# Altium schematic sheet 宁波2号线PIS_TQ2416底板_原理图_V0.1.schdoc
size 594 x 419 mm; SheetNumber: 0; SheetTotal: 0
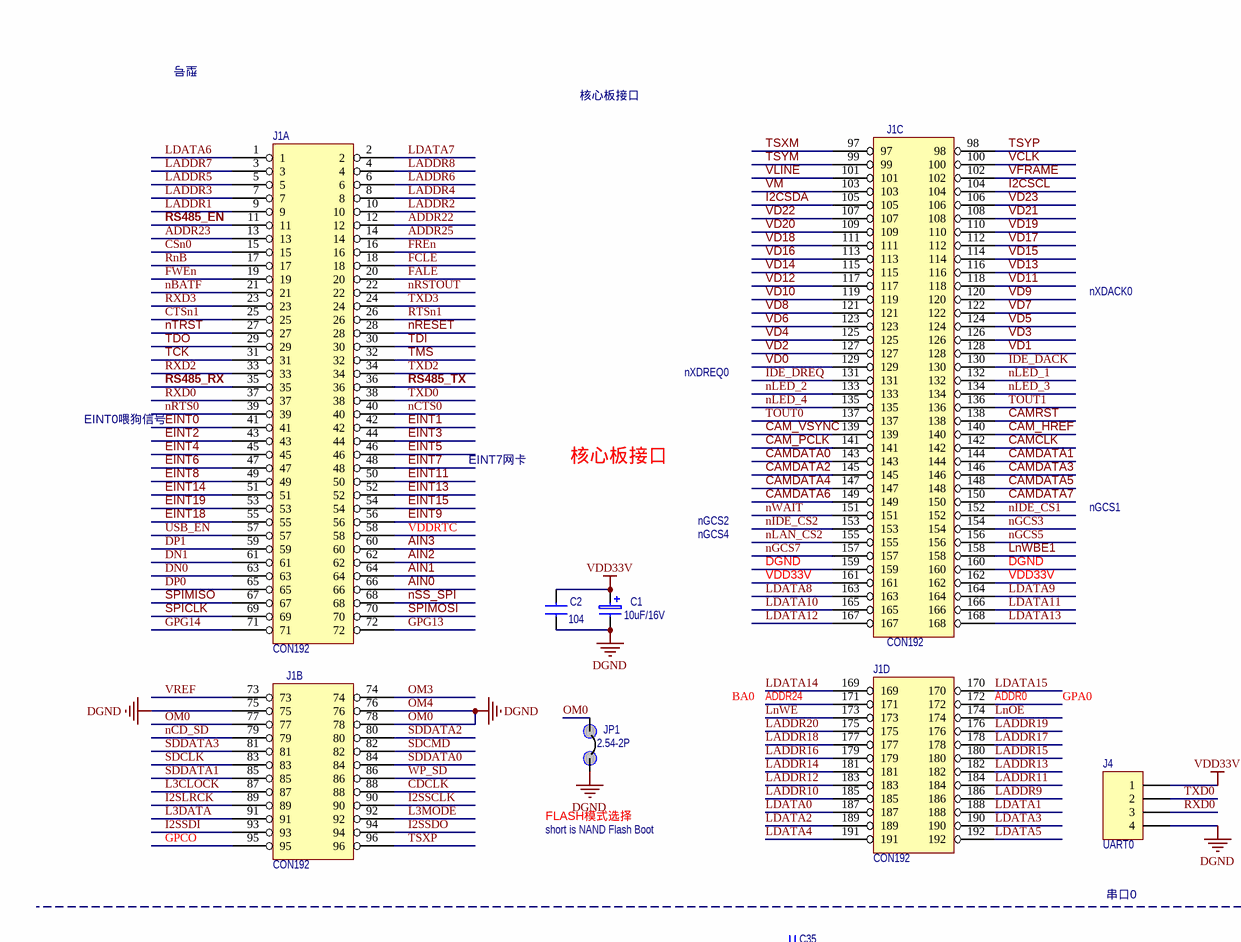
[diagram p0: 宁波2号线PIS_TQ2416底板_原理图_V0.1.schdoc, top left]
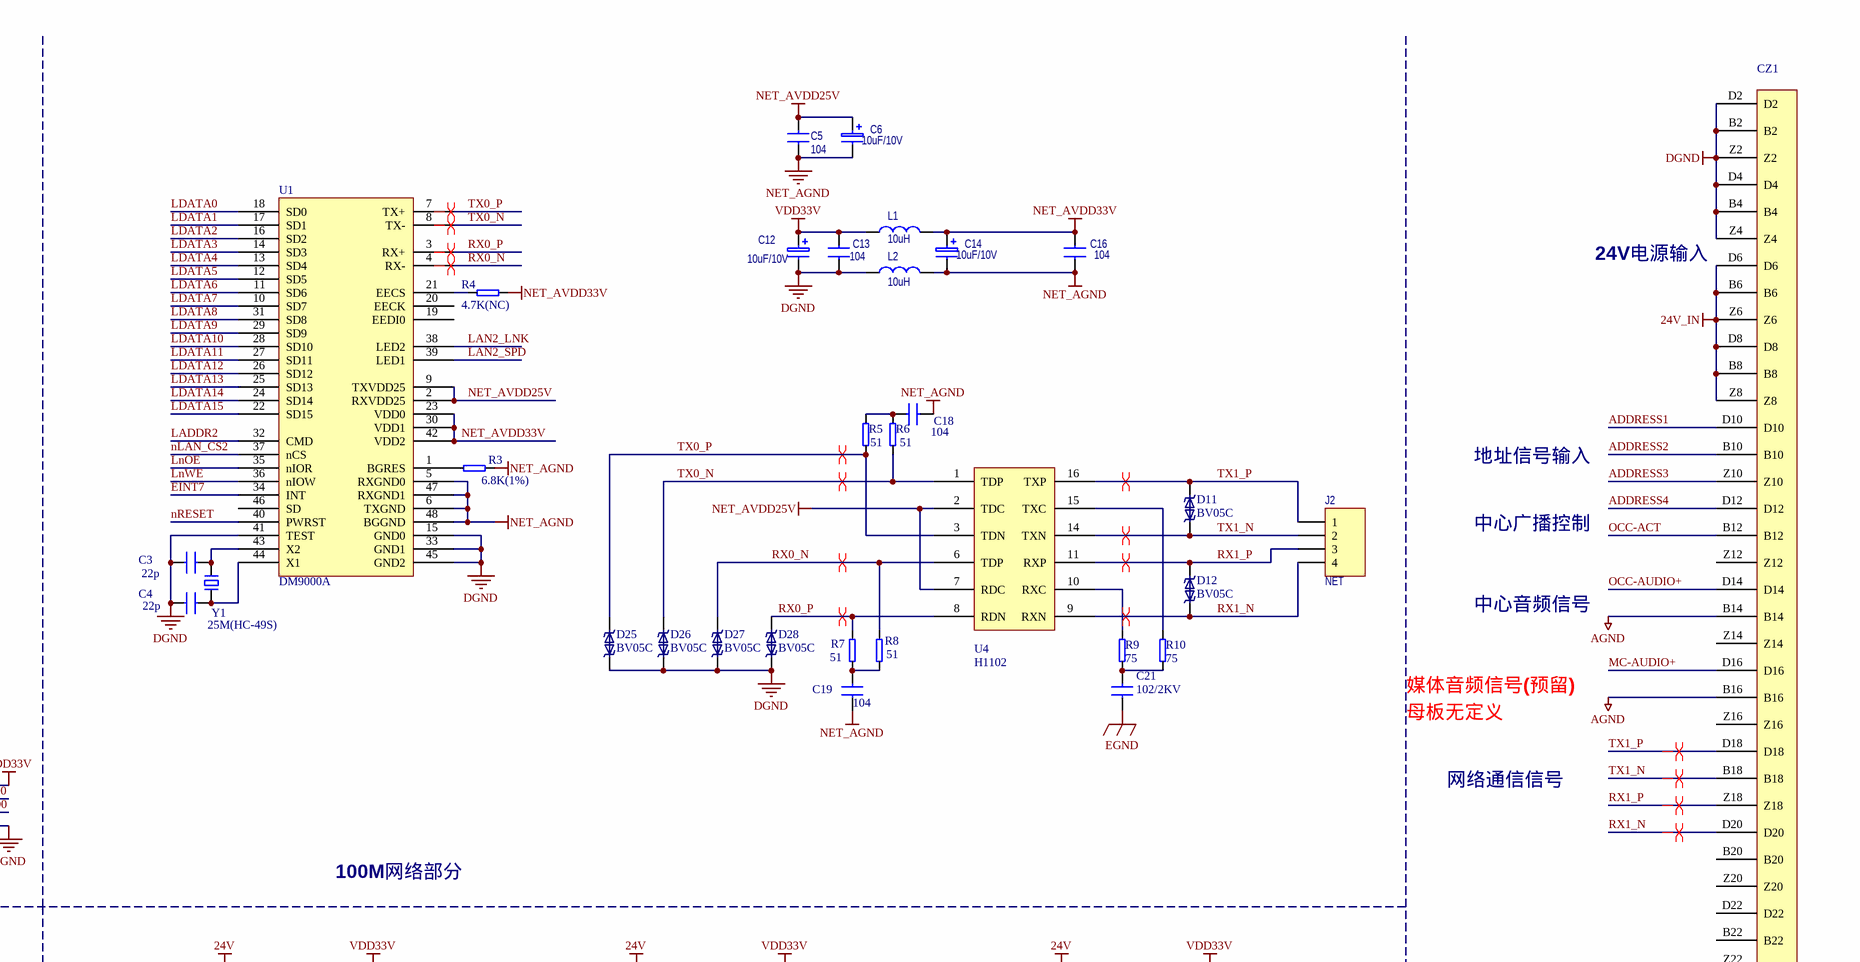
[diagram p1: 宁波2号线PIS_TQ2416底板_原理图_V0.1.schdoc, top right]
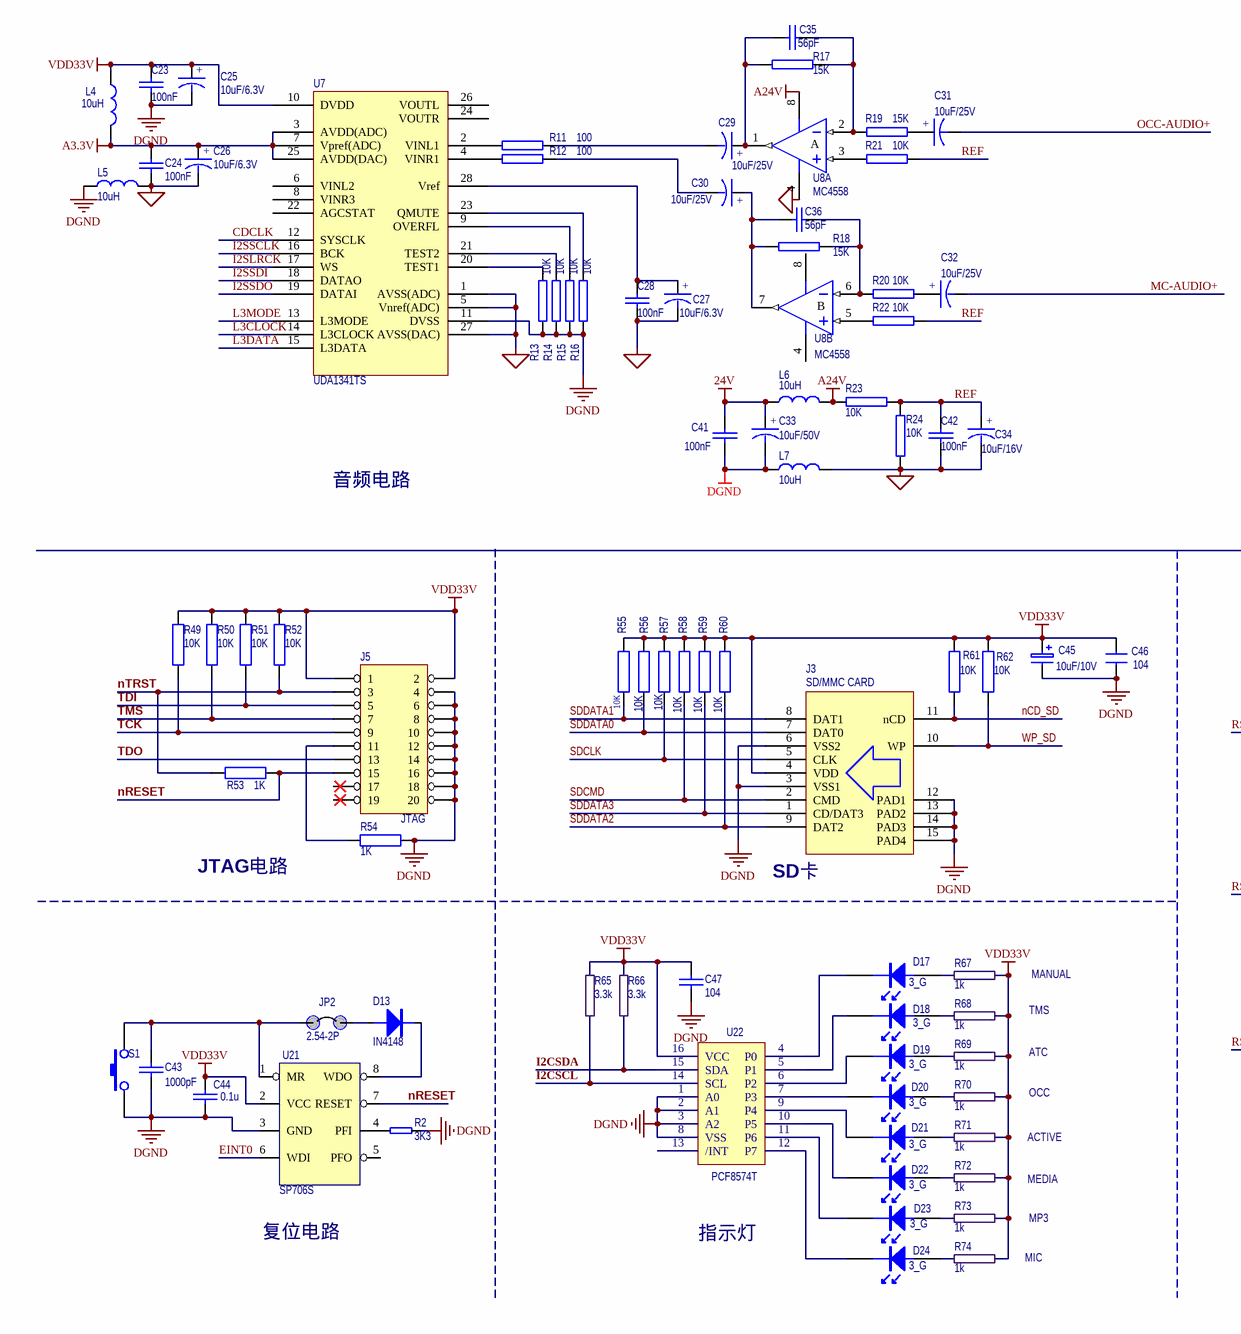
[diagram p2: 宁波2号线PIS_TQ2416底板_原理图_V0.1.schdoc, bottom left]
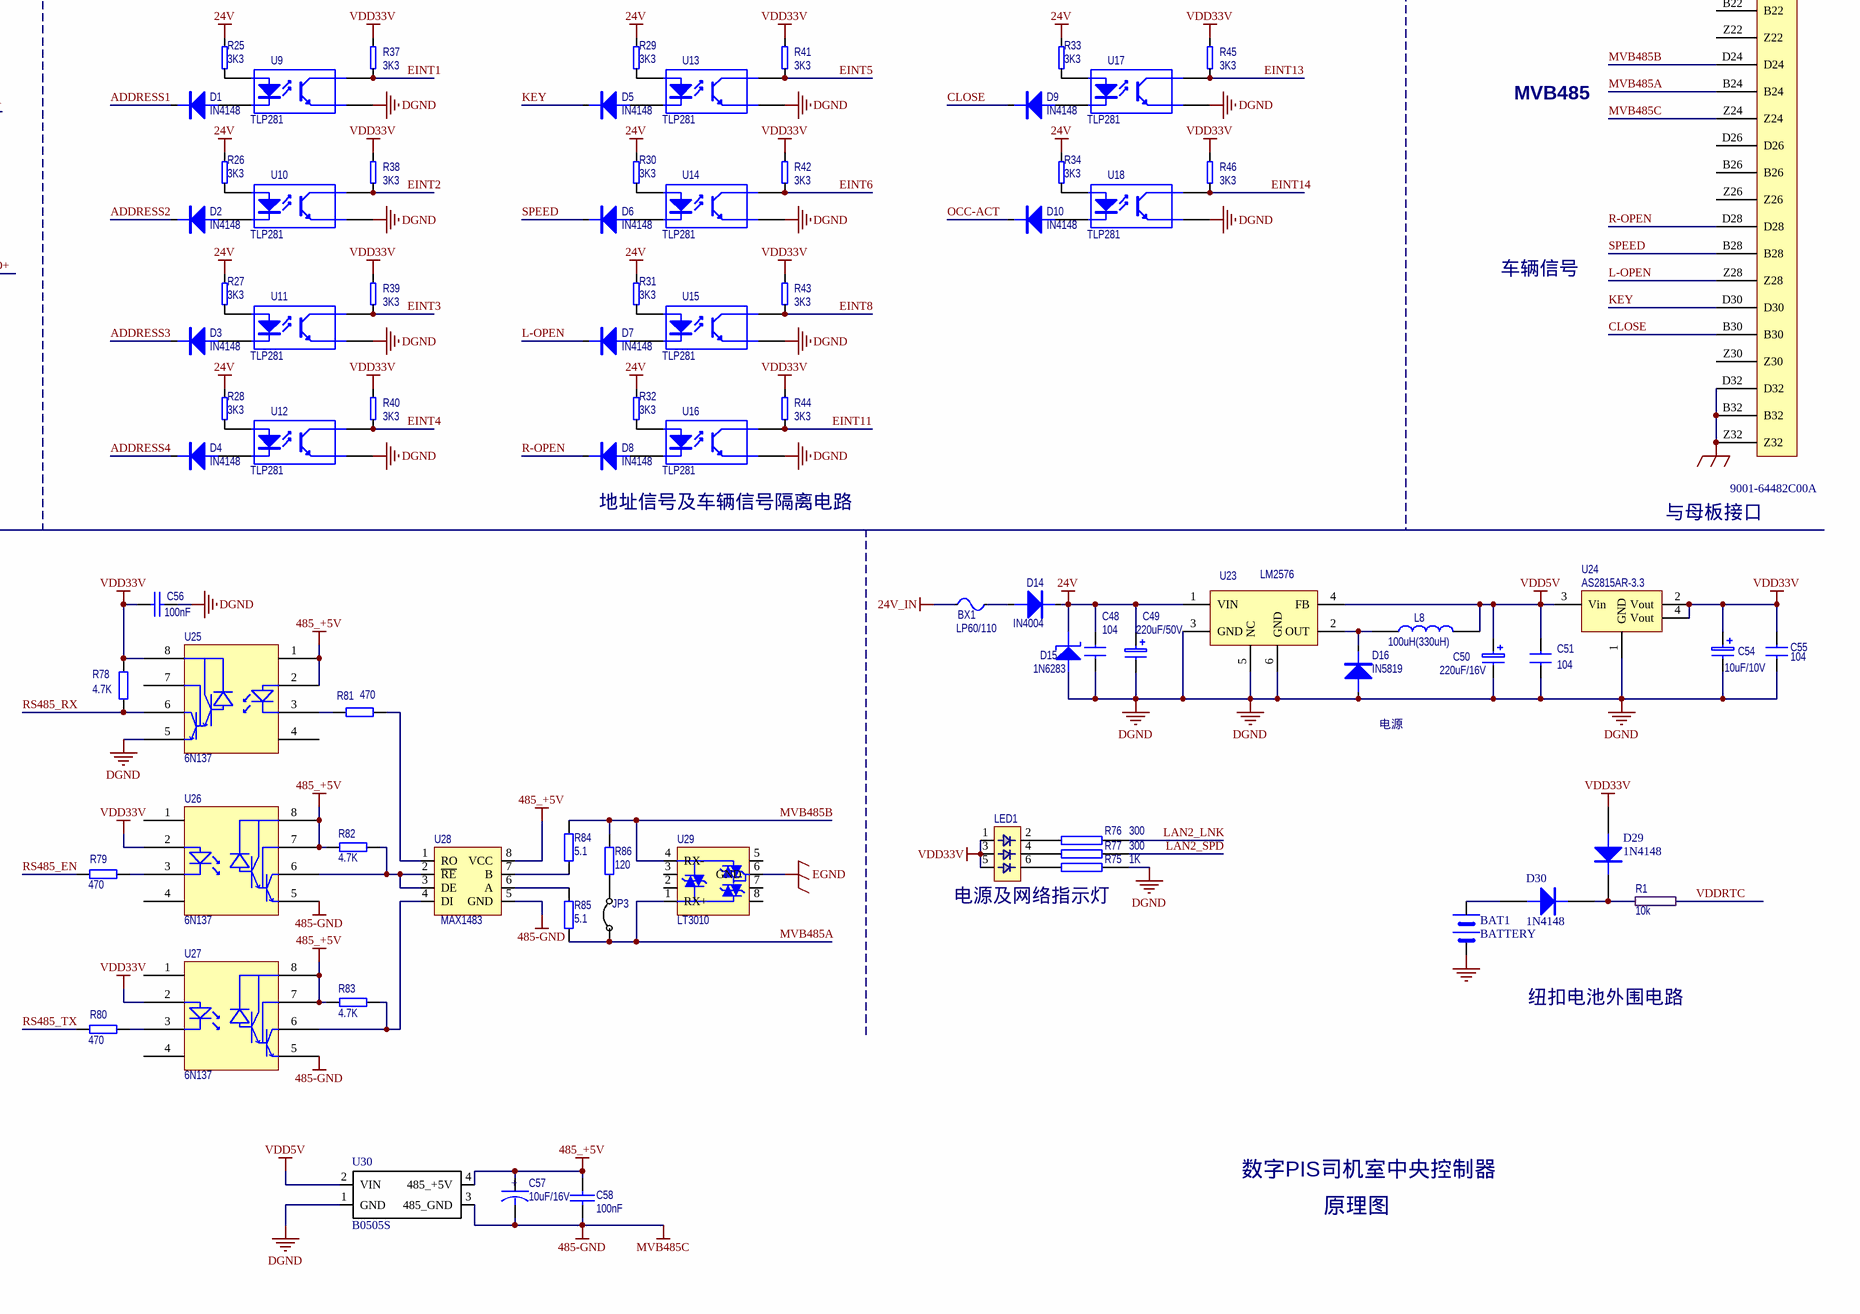
[diagram p3: 宁波2号线PIS_TQ2416底板_原理图_V0.1.schdoc, bottom right]

## Parts
BAT1  BATTERY  [BAT600]
BX1  LP60/110  [BX]
C1  value 10uF/16V  [1206E]  (hidden comment: 10uF/10V)
C2  104  [0805C]
C3  22p  [0805C]
C4  22p  [0805C]
C5  104  [0805C]
C6  10uF/10V  [1206E]
C12  10uF/10V  [1206E]
C13  104  [0805C]
C14  10uF/10V  [1206E]
C16  104  [0805C]
C18  104  [0805C]
C19  104  [0805C]
C21  102/2KV  [1206]
C23  100nF  [0805C]
C24  100nF  [0805C]
C25  10uF/6.3V  [1206E]
C26  10uF/6.3V  [1206E]
C27  10uF/6.3V  [1206E]
C28  100nF  [0805C]
C29  10uF/25V  [RB.1/.2]
C30  10uF/25V  [RB.1/.2]
C31  10uF/25V  [RB.1/.2]
C32  10uF/25V  [RB.1/.2]
C33  10uF/50V  [CAP-B]
C34  10uF/16V  [CAP-B]
C35  56pF  [0805C]
C36  56pF  [0805C]
C41  100nF  [0805C]
C42  100nF  [0805C]
C43  1000pF  [0805C]
C44  0.1u  [0805C]
C45  10uF/10V  [1206E]
C46  104  [0805C]
C47  104  [0805C]
C48  104  [0805C]
C49  220uF/50V  [RB.2/.4]
C50  220uF/16V  [RB.2/.4]
C51  104  [0805C]
C54  value 10uF/10V  [RB.2/.4]  (hidden comment: 220uF/16V)
C55  104  [0805C]
C56  100nF  [0805C]
C57  10uF/16V  [1206E]
C58  100nF  [0805C]
CZ1  9001-64482C00A  [HARTING09061486901]
D1  IN4148  [SOD-323]
D2  IN4148  [SOD-323]
D3  IN4148  [SOD-323]
D4  IN4148  [SOD-323]
D5  IN4148  [SOD-323]
D6  IN4148  [SOD-323]
D7  IN4148  [SOD-323]
D8  IN4148  [SOD-323]
D9  IN4148  [SOD-323]
D10  IN4148  [SOD-323]
D11  BV05C  [SOD-323]
D12  BV05C  [SOD-323]
D13  IN4148  [0805AK]
D14  IN4004  [1206AK]
D15  1N6283  [DIODE0.5]
D16  IN5819  [1206AK]
D17  3_G  [LED-1]
D18  3_G  [LED-1]
D19  3_G  [LED-1]
D20  3_G  [LED-1]
D21  3_G  [LED-1]
D22  3_G  [LED-1]
D23  3_G  [LED-1]
D24  3_G  [LED-1]
D25  BV05C  [SOD-323]
D26  BV05C  [SOD-323]
D27  BV05C  [SOD-323]
D28  BV05C  [SOD-323]
D29  1N4148  [SOD-323]
D30  1N4148  [SOD-323]
J1  CON192  [CON192_2.0]  (parts A,B,C,D of 4)
J2  NET  [SIP-4]
J3  SD/MMC CARD  [SD_CARD(LONG)]
J4  UART0  [SIP-4]
J5  JTAG  [DC3-20T]
JP1  2.54-2P  [JMP-2]
JP2  2.54-2P  [SIP-2]
JP3  (no value)  [SIP-2]
L1  10uH  [1206]
L2  10uH  [1206]
L4  10uH  [1206]
L5  10uH  [1206]
L6  10uH  [1206]
L7  10uH  [1206]
L8  100uH(330uH)  [DG300]
LED1  (no value)  [LED-3]
R1  10k  [0805R]
R2  3K3  [0805R]
R3  6.8K(1%)  [0805R]
R4  4.7K(NC)  [0805R]
R5  51  [0805R]
R6  51  [0805R]
R7  51  [0805R]
R8  51  [0805R]
R9  75  [0805R]
R10  75  [0805R]
R11  100  [0805R]
R12  100  [0805R]
R13  10K  [0805R]
R14  10K  [0805R]
R15  10K  [0805R]
R16  10K  [0805R]
R17  15K  [0805R]
R18  15K  [0805R]
R19  15K  [0805R]
R20  10K  [0805R]
R21  10K  [0805R]
R22  10K  [0805R]
R23  10K  [0805R]
R24  10K  [0805R]
R25  3K3  [0805R]
R26  3K3  [0805R]
R27  3K3  [0805R]
R28  3K3  [0805R]
R29  3K3  [0805R]
R30  3K3  [0805R]
R31  3K3  [0805R]
R32  3K3  [0805R]
R33  3K3  [0805R]
R34  3K3  [0805R]
R37  3K3  [0805R]
R38  3K3  [0805R]
R39  3K3  [0805R]
R40  3K3  [0805R]
R41  3K3  [0805R]
R42  3K3  [0805R]
R43  3K3  [0805R]
R44  3K3  [0805R]
R45  3K3  [0805R]
R46  3K3  [0805R]
R49  10K  [0805R]
R50  10K  [0805R]
R51  10K  [0805R]
R52  10K  [0805R]
R53  1K  [0805R]
R54  1K  [0805R]
R55  10K  [0805R]
R56  10K  [0805R]
R57  10K  [0805R]
R58  10K  [0805R]
R59  10K  [0805R]
R60  10K  [0805R]
R61  10K  [0805R]
R62  10K  [0805R]
R65  3.3k  [0805R]
R66  3.3k  [0805R]
R67  1k  [0805R]
R68  1k  [0805R]
R69  1k  [0805R]
R70  1k  [0805R]
R71  1k  [0805R]
R72  1k  [0805R]
R73  1k  [0805R]
R74  1k  [0805R]
R75  1K  [0805R]
R76  300  [0805R]
R77  300  [0805R]
R78  4.7K  [0805R]
R79  470  [0805R]
R80  470  [0805R]
R81  470  [0805R]
R82  4.7K  [0805R]
R83  4.7K  [0805R]
R84  5.1  [0805R]
R85  5.1  [0805R]
R86  120  [0805R]
S1  (no value)  [KEY-6A]
U1  DM9000A  [LQFP-48]
U4  H1102  [SOP-16(Wide)]
U7  UDA1341TS  [TSSOP-28]
U8  MC4558  [SOP-8]  (parts A,B of 2)
U9  TLP281  [SOP-4]
U10  TLP281  [SOP-4]
U11  TLP281  [SOP-4]
U12  TLP281  [SOP-4]
U13  TLP281  [SOP-4]
U14  TLP281  [SOP-4]
U15  TLP281  [SOP-4]
U16  TLP281  [SOP-4]
U17  TLP281  [SOP-4]
U18  TLP281  [SOP-4]
U21  SP706S  [SOP-8]
U22  PCF8574T  [SOP-16]
U23  LM2576  [LM2576]
U24  AS2815AR-3.3  [TO-252]
U25  6N137  [SOP-8-2.54]
U26  6N137  [SOP-8-2.54]
U27  6N137  [SOP-8-2.54]
U28  MAX1483  [SOP-8]
U29  LT3010  [SOP-8]
U30  B0505S  [B0505S]
Y1  25M(HC-49S)  [CRYSTAL]

## Nets
24V: C33.1 C41.1 C48.1 C49.1 D14.K D15.K L6.1 R25.2 R26.2 R27.2 R28.2 R29.2 R30.2 R31.2 R32.2 R33.2 R34.2 U23.1(VIN)
24V_IN: BX1.2 CZ1.B6 CZ1.B8 CZ1.D6 CZ1.D8 CZ1.Z6 CZ1.Z8
485_+5V: C57.1 C58.2 R82.1 R83.2 U25.1 U25.2 U26.7 U26.8 U27.7 U27.8 U28.8(VCC) U30.4(485_+5V)
A3.3V: C24.2 C26.1 L4.2 U7.3(AVDD(ADC)) U7.7(Vpref(ADC)) U7.25(AVDD(DAC))
A24V: L6.2 R23.2 U8.8(V+)
AGND: C24.1 C26.2 C27.2 C28.2 C34.2 C42.2 CZ1.B14 CZ1.B16 L5.2 L7.2 R24.2 U7.1(AVSS(ADC)) U7.5(Vnref(ADC)) U7.27(AVSS(DAC)) U8.4(V-)
DGND: BAT1.2 C1.2 C2.2 C3.1 C4.1 C12.2 C13.2 C23.1 C25.2 C33.2 C41.2 C43.2 C44.1 C45.2 C46.2 C47.1 C48.2 C49.2 C50.2 C51.2 C54.2 C55.2 C56.2 CZ1.B2 CZ1.B4 CZ1.D2 CZ1.D4 CZ1.Z2 CZ1.Z4 D15.A D16.A D25.A D26.A D27.A D28.A J1.75 J1.76 J1.77 J1.78 J1.159 J1.160 J3.3(VSS1) J3.6(VSS2) J3.12(PAD1) J3.13(PAD2) J3.14(PAD3) J3.15(PAD4) J4.4 J5.4 J5.6 J5.8 J5.10 J5.12 J5.14 J5.16 J5.18 J5.20 JP1.1 JP1.2 L2.1 L5.1 L7.1 R2.1 R13.1 R14.1 R15.1 R16.1 R54.2(BOT) R75.2 S1.1 U1.15(GND0) U1.33(GND1) U1.41(TEST) U1.45(GND2) U7.11(DVSS) U9.3(E) U10.3(E) U11.3(E) U12.3(E) U13.3(E) U14.3(E) U15.3(E) U16.3(E) U17.3(E) U18.3(E) U21.3(GND) U22.1(A0) U22.2(A1) U22.3(A2) U22.8(VSS) U23.3(GND) U23.5(NC) U23.6(GND) U24.1(GND) U25.5 U30.1(GND)  [also labelled OM0, OM4]
EGND: C21.2 CZ1.B32 CZ1.D32 CZ1.Z32 U29.6(GND)
MVB485C: C57.2 C58.1 CZ1.Z24 U26.5 U27.5 U28.5(GND) U30.3(485_GND)  [also labelled 485-GND]
NET_AGND: C5.2 C6.2 C14.2 C16.2 C18.2 C19.1 L2.2 R3.2 U1.5(RXGND0) U1.6(TXGND) U1.47(RXGND1) U1.48(BGGND)
NET_AVDD25V: C5.1 C6.1 U1.2(RXVDD25) U1.9(TXVDD25) U4.2(TDC) U4.7(RDC)
NET_AVDD33V: C14.1 C16.1 L1.2 R4.2 U1.23(VDD0) U1.30(VDD1) U1.42(VDD2)
VDD5V: C50.1 C51.1 L8.2 U23.4(FB) U24.3(Vin) U30.2(VIN)
VDD33V: C1.1 C2.1 C12.1 C13.1 C23.2 C25.1 C44.2 C45.1 C46.1 C47.2 C54.1 C55.1 C56.1 D29.A J1.161 J1.162 J3.4(VDD) J4.1 J5.1 J5.2 L1.1 L4.1 LED1.1 LED1.3 LED1.5 R37.2 R38.2 R39.2 R40.2 R41.2 R42.2 R43.2 R44.2 R45.2 R46.2 R49.1(TOP) R50.1(TOP) R51.1(TOP) R52.1(TOP) R55.1(TOP) R56.1(TOP) R57.1(TOP) R58.1(TOP) R59.1(TOP) R60.1(TOP) R61.1(TOP) R62.1(TOP) R65.1 R66.1 R67.1 R68.1 R69.1 R70.1 R71.1 R72.1 R73.1 R74.1 R78.2 U7.10(DVDD) U21.2(VCC) U22.16(VCC) U24.2(Vout) U24.4(Vout) U25.8 U26.2 U27.2
ADDR22: J1.12
ADDR23: J1.13
ADDR25: J1.14
ADDRESS1: CZ1.D10 D1.K
ADDRESS2: CZ1.B10 D2.K
ADDRESS3: CZ1.Z10 D3.K
ADDRESS4: CZ1.D12 D4.K
AIN0: J1.66
AIN1: J1.64
AIN2: J1.62
AIN3: J1.60
CAM_HREF: J1.140
CAM_PCLK: J1.141
CAM_VSYNC: J1.139
CAMCLK: J1.142
CAMDATA0: J1.143
CAMDATA1: J1.144
CAMDATA2: J1.145
CAMDATA3: J1.146
CAMDATA4: J1.147
CAMDATA5: J1.148
CAMDATA6: J1.149
CAMDATA7: J1.150
CAMRST: J1.138
CDCLK: J1.88 U7.12(SYSCLK)
CLOSE: CZ1.B30 D9.K
CSn0: J1.15
CTSn1: J1.25
DN0: J1.63
DN1: J1.61
DP0: J1.65
DP1: J1.59
EINT0: J1.41 U21.6(WDI)
EINT1: J1.42 R37.1 U9.4(C)
EINT2: J1.43 R38.1 U10.4(C)
EINT3: J1.44 R39.1 U11.4(C)
EINT4: J1.45 R40.1 U12.4(C)
EINT5: J1.46 R41.1 U13.4(C)
EINT6: J1.47 R42.1 U14.4(C)
EINT7: J1.48 U1.34(INT)
EINT8: J1.49 R43.1 U15.4(C)
EINT9: J1.56
EINT11: J1.50 R44.1 U16.4(C)
EINT13: J1.52 R45.1 U17.4(C)
EINT14: J1.51 R46.1 U18.4(C)
EINT15: J1.54
EINT18: J1.55
EINT19: J1.53
FALE: J1.20
FCLE: J1.18
FREn: J1.16
FWEn: J1.19
GPCO: J1.95
GPG13: J1.72
GPG14: J1.71
I2CSCL: J1.104 R65.2 U22.14(SCL)
I2CSDA: J1.105 R66.2 U22.15(SDA)
I2SLRCK: J1.89 U7.17(WS)
I2SSCLK: J1.90 U7.16(BCK)
I2SSDI: J1.93 U7.18(DATAO)
I2SSDO: J1.94 U7.19(DATAI)
IDE_DACK: J1.130
IDE_DREQ: J1.131
KEY: CZ1.D30 D5.K
L3CLOCK: J1.87 U7.14(L3CLOCK)
L3DATA: J1.91 U7.15(L3DATA)
L3MODE: J1.92 U7.13(L3MODE)
L-OPEN: CZ1.Z28 D7.K
LADDR1: J1.9
LADDR2: J1.10 U1.32(CMD)
LADDR3: J1.7
LADDR4: J1.8
LADDR5: J1.5
LADDR6: J1.6
LADDR7: J1.3
LADDR8: J1.4
LADDR9: J1.186
LADDR10: J1.185
LADDR11: J1.184
LADDR12: J1.183
LADDR13: J1.182
LADDR14: J1.181
LADDR15: J1.180
LADDR16: J1.179
LADDR17: J1.178
LADDR18: J1.177
LADDR19: J1.176
LADDR20: J1.175
LAN2_LNK: R76.2 U1.38(LED2)
LAN2_SPD: R77.2 U1.39(LED1)
LDATA0: J1.187 U1.18(SD0)
LDATA1: J1.188 U1.17(SD1)
LDATA2: J1.189 U1.16(SD2)
LDATA3: J1.190 U1.14(SD3)
LDATA4: J1.191 U1.13(SD4)
LDATA5: J1.192 U1.12(SD5)
LDATA6: J1.1 U1.11(SD6)
LDATA7: J1.2 U1.10(SD7)
LDATA8: J1.163 U1.31(SD8)
LDATA9: J1.164 U1.29(SD9)
LDATA10: J1.165 U1.28(SD10)
LDATA11: J1.166 U1.27(SD11)
LDATA12: J1.167 U1.26(SD12)
LDATA13: J1.168 U1.25(SD13)
LDATA14: J1.169 U1.24(SD14)
LDATA15: J1.170 U1.22(SD15)
LnOE: J1.174 U1.35(nIOR)
LnWBE1: J1.158
LnWE: J1.173 U1.36(nIOW)
MC-AUDIO+: C32.2 CZ1.D16
MVB485A: CZ1.B24 JP3.1 R85.2 U29.1(RX+)
MVB485B: CZ1.D24 R84.1 R86.2 U29.4(RX-)
nBATF: J1.21
nCD_SD: J1.79 J3.11(nCD) R61.2(BOT)
nCTS0: J1.40
nGCS3: J1.154
nGCS5: J1.156
nGCS7: J1.157
nIDE_CS1: J1.152
nIDE_CS2: J1.153
nLAN_CS2: J1.155 U1.37(nCS)
nLED_1: J1.132
nLED_2: J1.133
nLED_3: J1.134
nLED_4: J1.135
nRESET: J1.28 J5.15 R53.2(BOT) U1.40(PWRST) U21.7(RESET)
nRSTOUT: J1.22
nRTS0: J1.39
nSS_SPI: J1.68
nTRST: J1.27 J5.3 R52.2(BOT) R53.1(TOP)
nWAIT: J1.151
OCC-ACT: CZ1.B12 D10.K
OCC-AUDIO+: C31.2 CZ1.D14
OM3: J1.74
R-OPEN: CZ1.D28 D8.K
REF: C34.1 C42.1 R21.2 R22.1 R23.1 R24.1
RnB: J1.17
RS485_EN: J1.11 R79.1
RS485_RX: J1.35 R78.1 U25.6
RS485_TX: J1.36 R80.1
RTSn1: J1.26
RX0_N: D27.K R8.2 U1.4(RX-) U4.6(TDP)
RX0_P: D28.K R7.2 U1.3(RX+) U4.8(RDN)
RX1_N: CZ1.D20 D12.A J2.4 U4.9(RXN)
RX1_P: CZ1.Z18 D12.K J2.3 U4.11(RXP)
RXD0: J1.37 J4.3
RXD2: J1.33
RXD3: J1.23
SDCLK: J1.83 J3.5(CLK) R57.2(BOT)
SDCMD: J1.82 J3.2(CMD) R58.2(BOT)
SDDATA0: J1.84 J3.7(DAT0) R56.2(BOT)
SDDATA1: J1.85 J3.8(DAT1) R55.2(BOT)
SDDATA2: J1.80 J3.9(DAT2) R60.2(BOT)
SDDATA3: J1.81 J3.1(CD/DAT3) R59.2(BOT)
SPEED: CZ1.B28 D6.K
SPICLK: J1.69
SPIMISO: J1.67
SPIMOSI: J1.70
TCK: J1.31 J5.9 R49.2(BOT)
TDI: J1.30 J5.5 R51.2(BOT)
TDO: J1.29 J5.13
TMS: J1.32 J5.7 R50.2(BOT)
TOUT0: J1.137
TOUT1: J1.136
TSXM: J1.97
TSXP: J1.96
TSYM: J1.99
TSYP: J1.98
TX0_N: D26.K R6.1 U1.8(TX-) U4.1(TDP)
TX0_P: D25.K R5.1 U1.7(TX+) U4.3(TDN)
TX1_N: CZ1.B18 D11.A J2.2 U4.14(TXN)
TX1_P: CZ1.D18 D11.K J2.1 U4.16(TXP)
TXD0: J1.38 J4.2
TXD2: J1.34
TXD3: J1.24
USB_EN: J1.57
VCLK: J1.100
VD0: J1.129
VD1: J1.128
VD2: J1.127
VD3: J1.126
VD4: J1.125
VD5: J1.124
VD6: J1.123
VD7: J1.122
VD8: J1.121
VD9: J1.120
VD10: J1.119
VD11: J1.118
VD12: J1.117
VD13: J1.116
VD14: J1.115
VD15: J1.114
VD16: J1.113
VD17: J1.112
VD18: J1.111
VD19: J1.110
VD20: J1.109
VD21: J1.108
VD22: J1.107
VD23: J1.106
VDDRTC: J1.58 R1.2
VFRAME: J1.102
VLINE: J1.101
VM: J1.103
VREF: J1.73
WP_SD: J1.86 J3.10(WP) R62.2(BOT)
NetBAT1_1: BAT1.1 D30.A
NetBX1_1: BX1.1 D14.A
NetC3_2: C3.2 U1.43(X2) Y1.1
NetC4_2: C4.2 U1.44(X1) Y1.2
NetC18_1: C18.1 R5.2 R6.2
NetC19_2: C19.2 R7.1 R8.1
NetC21_1: C21.1 R9.1 R10.1
NetC27_1: C27.1 C28.1 U7.28(Vref)
NetC29_1: C29.1 C35.1 R17.2 U8.1(OUT)
NetC29_2: C29.2 R11.1
NetC30_1: C30.1 C36.1 R18.2 U8.7(OUT)
NetC30_2: C30.2 R12.1
NetC31_1: C31.1 R19.2
NetC32_1: C32.1 R20.1
NetC35_2: C35.2 R17.1 R19.1 U8.2(IN-)
NetC36_2: C36.2 R18.1 R20.2 U8.6(IN-)
NetC43_1: C43.1 JP2.1 S1.2 U21.1(MR)
NetD1_A: D1.A U9.2(K)
NetD2_A: D2.A U10.2(K)
NetD3_A: D3.A U11.2(K)
NetD4_A: D4.A U12.2(K)
NetD5_A: D5.A U13.2(K)
NetD6_A: D6.A U14.2(K)
NetD7_A: D7.A U15.2(K)
NetD8_A: D8.A U16.2(K)
NetD9_A: D9.A U17.2(K)
NetD10_A: D10.A U18.2(K)
NetD13_A: D13.A JP2.2
NetD13_K: D13.K U21.8(WDO)
NetD16_K: D16.K L8.1 U23.2(OUT)
NetD17_A: D17.A R67.2
NetD17_K: D17.K U22.4(P0)
NetD18_A: D18.A R68.2
NetD18_K: D18.K U22.5(P1)
NetD19_A: D19.A R69.2
NetD19_K: D19.K U22.6(P2)
NetD20_A: D20.A R70.2
NetD20_K: D20.K U22.7(P3)
NetD21_A: D21.A R71.2
NetD21_K: D21.K U22.9(P4)
NetD22_A: D22.A R72.2
NetD22_K: D22.K U22.10(P5)
NetD23_A: D23.A R73.2
NetD23_K: D23.K U22.11(P6)
NetD24_A: D24.A R74.2
NetD24_K: D24.K U22.12(P7)
NetD29_K: D29.K D30.K R1.1
NetJ5_11: J5.11 R54.1(TOP)
NetJP3_2: JP3.2 R86.1
NetLED1_2: LED1.2 R76.1
NetLED1_4: LED1.4 R77.1
NetLED1_6: LED1.6 R75.1
NetR2_2: R2.2 U21.4(PFI)
NetR3_1: R3.1 U1.1(BGRES)
NetR4_1: R4.1 U1.21(EECS)
NetR9_2: R9.2 U4.10(RXC)
NetR10_2: R10.2 U4.15(TXC)
NetR11_2: R11.2 U7.2(VINL1)
NetR12_2: R12.2 U7.4(VINR1)
NetR13_2: R13.2 U7.20(TEST1)
NetR14_2: R14.2 U7.21(TEST2)
NetR15_2: R15.2 U7.9(OVERFL)
NetR16_2: R16.2 U7.23(QMUTE)
NetR21_1: R21.1 U8.3(IN+)
NetR22_2: R22.2 U8.5(IN+)
NetR25_1: R25.1 U9.1(A)
NetR26_1: R26.1 U10.1(A)
NetR27_1: R27.1 U11.1(A)
NetR28_1: R28.1 U12.1(A)
NetR29_1: R29.1 U13.1(A)
NetR30_1: R30.1 U14.1(A)
NetR31_1: R31.1 U15.1(A)
NetR32_1: R32.1 U16.1(A)
NetR33_1: R33.1 U17.1(A)
NetR34_1: R34.1 U18.1(A)
NetR79_2: R79.2 U26.3
NetR80_2: R80.2 U27.3
NetR81_1: R81.1 U25.3
NetR81_2: R81.2 U28.1(RO)
NetR82_2: R82.2 U26.6 U28.2(~{RE}) U28.3(DE)
NetR83_1: R83.1 U27.6 U28.4(DI)
NetR84_2: R84.2 U28.7(B)
NetR85_1: R85.1 U28.6(A)

Not connected (* = marked no-connect by the designer): CZ1 B20 B22 B26 D22 D26 Z12 Z14 Z16 Z20 Z22 Z26 Z30; J1 171 172; J5 17 19; U1 19(EEDI0) 20(EECK) 46(SD); U7 6(VINL2) 8(VINR3) 22(AGCSTAT) 24(VOUTR) 26(VOUTL); U21 5(PFO); U22 13(/INT); U25 4 7; U26 1 4; U27 1 4; U29 2(NC) 3(NC) 5(NC) 7(NC) 8(NC)

## Layout directives
differential pair: (no net found under the mark), RX0_N, RX0_P, RX1_N, RX1_P, TX0_N, TX0_P, TX1_N, TX1_P

## Notes on the sheet
- 型号
- 核心板接口
- nXDACK0
- 24V电源输入
- nXDREQ0
- EINT0喂狗信号
- EINT7网卡
- nGCS1
- 地址信号输入
- nGCS4
- nGCS2
- 中心广播控制
- 中心音频信号
- BA0
- ADDR24
- (near J1) ADDR0
- GPA0
- 媒体音频信号(预留)
- 母板无定义
- (near JP1) FLASH模式选择
- short is NAND Flash Boot
- 网络通信信号
- 串口0
- 100M网络部分
- MVB485
- 车辆信号
- 音频电路
- 地址信号及车辆信号隔离电路
- 与母板接口
- (near D16) 电源
- JTAG电路
- (near J3) SD卡
- (near LED1) 电源及网络指示灯
- TMS
- MANUAL
- ATC
- 纽扣电池外围电路
- ACTIVE
- OCC
- MEDIA
- 数字PIS司机室中央控制器
- 复位电路
- 指示灯
- MIC
- MP3
- 原理图
- 媒体编号
- 旧底图总号
- 更改
- 标记
- 数量
- 更改单号
- 签 名
- 日期
- 底图总号
- 拟  制
- 审  核
- 标准化
- 第      张
- 天津市北海通信技术有限公司
- 共      张
- 格式
- (3)
- 制图
- 批  准
- ：
- 描图
- 图幅
- (in symbol CAPACITOR POL) +
- (in symbol OP295GS, part A) A
- (in symbol OP295GS, part B) B

## Library data of the parts
BX1 = BX1: Part Field 1: 10K; Part Field 2: 10K; Part Field 3: 10K; Part Field 4: 10K; Part Field 5: 10K; Part Field 6: 10K; Part Field 7: 10K; Part Field 8: 10K; Part Field 9: 10K; Part Field 10: 10K; Part Field 11: 10K; Part Field 12: 10K; Part Field 13: 10K; Part Field 14: 10K; Part Field 15: 10K; Part Field 16: 10K
C1 C6 C12 C14 C45 C49 C50 C54 = CAPBP2: Bi-Polar Capacitor; Part Field 10: 10K; Text Field1: Published 8-Jun-2000; Part Field 2: 10K; Part Field 3: 10K; Part Field 4: 10K; Part Field 5: 10K; Part Field 6: 10K; Part Field 7: 10K; Part Field 8: 10K; Part Field 9: 10K; Part Field 11: 10K; Part Field 12: 10K; Part Field 13: 10K; Part Field 14: 10K; Part Field 15: 10K; Part Field 16: 10K
  C6 C12 C14 C45: Value: 10uF/10V
  C49: Value: 220uF/50V
  C50: Value: 220uF/16V
C2 C5 C13 C16 C46 C48 C51 C55 = CAP: Capacitor; Part Field 10: 10K; Value: 104; Part Field 2: 10K; Part Field 3: 10K; Part Field 4: 10K; Part Field 5: 10K; Part Field 6: 10K; Part Field 7: 10K; Part Field 8: 10K; Part Field 9: 10K; Part Field 11: 10K; Part Field 12: 10K; Part Field 13: 10K; Part Field 14: 10K; Part Field 15: 10K; Part Field 16: 10K
C3 C4 C18 C19 C41 C47 C56 = CAP: Capacitor
  C3 C4: Value: 22p
  C18 C19: Value: 104
C21 = CAP: Capacitor; Value: 0.01uF/2KV
C23 C24 C28 C35 C36 C42-C44 C58 = CAP: Capacitor; Part Field 1: 10K; Part Field 2: 10K; Part Field 3: 10K; Part Field 4: 10K; Part Field 5: 10K; Part Field 6: 10K; Part Field 7: 10K; Part Field 8: 10K; Part Field 9: 10K; Part Field 10: 10K; Part Field 11: 10K; Part Field 12: 10K; Part Field 13: 10K; Part Field 14: 10K; Part Field 15: 10K; Part Field 16: 10K
C25-C27 C29-C34 C57 = CAPACITOR POL: Capacitor; Part Field 1: 10K; Part Field 2: 10K; Part Field 3: 10K; Part Field 4: 10K; Part Field 5: 10K; Part Field 6: 10K; Part Field 7: 10K; Part Field 8: 10K; Part Field 9: 10K; Part Field 10: 10K; Part Field 11: 10K; Part Field 12: 10K; Part Field 13: 10K; Part Field 14: 10K; Part Field 15: 10K; Part Field 16: 10K
CZ1 = HARTING-48P
D1-D10 D13 D14 D16 = DIODE: Part Field 1: 10K; Part Field 2: 10K; Part Field 3: 10K; Part Field 4: 10K; Part Field 5: 10K; Part Field 6: 10K; Part Field 7: 10K; Part Field 8: 10K; Part Field 9: 10K; Part Field 10: 10K; Part Field 11: 10K; Part Field 12: 10K; Part Field 13: 10K; Part Field 14: 10K; Part Field 15: 10K; Part Field 16: 10K
D15 = ZENER2: Zener Diode; Part Field 1: 10K; Part Field 2: 10K; Part Field 3: 10K; Part Field 4: 10K; Part Field 5: 10K; Part Field 6: 10K; Part Field 7: 10K; Part Field 8: 10K; Part Field 9: 10K; Part Field 10: 10K; Part Field 11: 10K; Part Field 12: 10K; Part Field 13: 10K; Part Field 14: 10K; Part Field 15: 10K; Part Field 16: 10K
D17-D24 = LED
D29 D30 = DIODE
J1 = CON192: Part Field 1: 10K; Part Field 2: 10K; Part Field 3: 10K; Part Field 4: 10K; Part Field 5: 10K; Part Field 6: 10K; Part Field 7: 10K; Part Field 8: 10K; Part Field 9: 10K; Part Field 10: 10K; Part Field 11: 10K; Part Field 12: 10K; Part Field 13: 10K; Part Field 14: 10K; Part Field 15: 10K; Part Field 16: 10K
J2 J4 = Header 4: Header, 4-Pin; Part Field 10: 10K; LatestRevisionDate: 10K; LatestRevisionNote: 10K; Publisher: 10K; Part Field 4: 10K; Part Field 5: 10K; Part Field 6: 10K; Part Field 7: 10K; Part Field 8: 10K; Part Field 9: 10K; Part Field 11: 10K; Part Field 12: 10K; Part Field 13: 10K; Part Field 14: 10K; Part Field 15: 10K; Part Field 16: 10K
J3 = SD-CARD: Part Field 1: 10K; Part Field 2: 10K; Part Field 3: 10K; Part Field 4: 10K; Part Field 5: 10K; Part Field 6: 10K; Part Field 7: 10K; Part Field 8: 10K; Part Field 9: 10K; Part Field 10: 10K; Part Field 11: 10K; Part Field 12: 10K; Part Field 13: 10K; Part Field 14: 10K; Part Field 15: 10K; Part Field 16: 10K
J5 = HEADER 10X2
JP1 JP2 = TX: Part Field 1: 10K; Part Field 2: 10K; Part Field 3: 10K; Part Field 4: 10K; Part Field 5: 10K; Part Field 6: 10K; Part Field 7: 10K; Part Field 8: 10K; Part Field 9: 10K; Part Field 10: 10K; Part Field 11: 10K; Part Field 12: 10K; Part Field 13: 10K; Part Field 14: 10K; Part Field 15: 10K; Part Field 16: 10K
JP3 = J2
L1 L2 L4-L8 = INDUCTOR1: Part Field 1: 10K; Part Field 2: 10K; Part Field 3: 10K; Part Field 4: 10K; Part Field 5: 10K; Part Field 6: 10K; Part Field 7: 10K; Part Field 8: 10K; Part Field 9: 10K; Part Field 10: 10K; Part Field 11: 10K; Part Field 12: 10K; Part Field 13: 10K; Part Field 14: 10K; Part Field 15: 10K; Part Field 16: 10K
LED1 = 3-LED: Part Field 1: 10K; Part Field 2: 10K; Part Field 3: 10K; Part Field 4: 10K; Part Field 5: 10K; Part Field 6: 10K; Part Field 7: 10K; Part Field 8: 10K; Part Field 9: 10K; Part Field 10: 10K; Part Field 11: 10K; Part Field 12: 10K; Part Field 13: 10K; Part Field 14: 10K; Part Field 15: 10K; Part Field 16: 10K
R1 R3-R10 = R
  R1: Part Field 1: 10K; Part Field 2: 10K; Part Field 3: 10K; Part Field 4: 10K; Part Field 5: 10K; Part Field 6: 10K; Part Field 7: 10K; Part Field 8: 10K; Part Field 9: 10K; Part Field 10: 10K; Part Field 11: 10K; Part Field 12: 10K; Part Field 13: 10K; Part Field 14: 10K; Part Field 15: 10K; Part Field 16: 10K
R2 R25-R34 R37-R46 R65-R74 = R: Part Field 1: 10K; Part Field 2: 10K; Part Field 3: 10K; Part Field 4: 10K; Part Field 5: 10K; Part Field 6: 10K; Part Field 7: 10K; Part Field 8: 10K; Part Field 9: 10K; Part Field 10: 10K; Part Field 11: 10K; Part Field 12: 10K; Part Field 13: 10K; Part Field 14: 10K; Part Field 15: 10K; Part Field 16: 10K
R11 R12 R17-R19 R75-R77 = RES2: Part Field 1: 10K; Part Field 2: 10K; Part Field 3: 10K; Part Field 4: 10K; Part Field 5: 10K; Part Field 6: 10K; Part Field 7: 10K; Part Field 8: 10K; Part Field 9: 10K; Part Field 10: 10K; Part Field 11: 10K; Part Field 12: 10K; Part Field 13: 10K; Part Field 14: 10K; Part Field 15: 10K; Part Field 16: 10K
R13-R16 R20-R24 R78-R86 = RES2
  R13-R16 R20-R24: Part Field 1: 10K; Part Field 2: 10K; Part Field 3: 10K; Part Field 4: 10K; Part Field 5: 10K; Part Field 6: 10K; Part Field 7: 10K; Part Field 8: 10K; Part Field 9: 10K; Part Field 10: 10K; Part Field 11: 10K; Part Field 12: 10K; Part Field 13: 10K; Part Field 14: 10K; Part Field 15: 10K; Part Field 16: 10K
R49-R52 R55-R62 = RES2: Resistor; Text Field1: Published 8-Jun-2000; Value: 10K; Part Field 2: 10K; Part Field 3: 10K; Part Field 4: 10K; Part Field 5: 10K; Part Field 6: 10K; Part Field 7: 10K; Part Field 8: 10K; Part Field 9: 10K; Part Field 10: 10K; Part Field 11: 10K; Part Field 12: 10K; Part Field 13: 10K; Part Field 14: 10K; Part Field 15: 10K; Part Field 16: 10K
R53 R54 = RES2: Resistor; Text Field1: Published 8-Jun-2000; Value: 10K; Part Field 2: 10K; Part Field 3: 10K; Part Field 4: 10K; Part Field 5: 10K; Part Field 6: 10K; Part Field 7: 10K; Part Field 8: 10K; Part Field 9: 10K; Part Field 10: 10K; Part Field 11: 10K; Part Field 12: 10K; Part Field 13: 10K; Part Field 14: 10K; Part Field 15: 10K; Part Field 16: 10K
S1 = SW-PB: Part Field 1: 10K; Part Field 2: 10K; Part Field 3: 10K; Part Field 4: 10K; Part Field 5: 10K; Part Field 6: 10K; Part Field 7: 10K; Part Field 8: 10K; Part Field 9: 10K; Part Field 10: 10K; Part Field 11: 10K; Part Field 12: 10K; Part Field 13: 10K; Part Field 14: 10K; Part Field 15: 10K; Part Field 16: 10K
U7 = UDA1341TS: Part Field 1: 10K; Part Field 2: 10K; Part Field 3: 10K; Part Field 4: 10K; Part Field 5: 10K; Part Field 6: 10K; Part Field 7: 10K; Part Field 8: 10K; Part Field 9: 10K; Part Field 10: 10K; Part Field 11: 10K; Part Field 12: 10K; Part Field 13: 10K; Part Field 14: 10K; Part Field 15: 10K; Part Field 16: 10K
U8 = OP295GS: Dual Rail-to-Rail Operational Amplifier; PackageDocument: 10K; Published: 10K; LatestRevisionDate: 10K; LatestRevisionNote: 10K; DatasheetDocument: 10K; PackageReference: 10K; Publisher: 10K; Code_JEDEC: 10K; Code_IPC: 10K; ComponentLink1Description: 10K; ComponentLink1URL: 10K; ComponentLink2Description: 10K; ComponentLink2URL: 10K; Part Field 14: 10K; Part Field 15: 10K; Part Field 16: 10K
U9-U18 = OPTOISO1: Optoisolator
U21 = MAX706R: Part Field 1: 10K; Part Field 2: 10K; Part Field 3: 10K; Part Field 4: 10K; Part Field 5: 10K; Part Field 6: 10K; Part Field 7: 10K; Part Field 8: 10K; Part Field 9: 10K; Part Field 10: 10K; Part Field 11: 10K; Part Field 12: 10K; Part Field 13: 10K; Part Field 14: 10K; Part Field 15: 10K; Part Field 16: 10K
U22 = PCF8574: Part Field 1: 10K; Part Field 2: 10K; Part Field 3: 10K; Part Field 4: 10K; Part Field 5: 10K; Part Field 6: 10K; Part Field 7: 10K; Part Field 8: 10K; Part Field 9: 10K; Part Field 10: 10K; Part Field 11: 10K; Part Field 12: 10K; Part Field 13: 10K; Part Field 14: 10K; Part Field 15: 10K; Part Field 16: 10K
U23 = LM2576: Part Field 1: 10K; Part Field 2: 10K; Part Field 3: 10K; Part Field 4: 10K; Part Field 5: 10K; Part Field 6: 10K; Part Field 7: 10K; Part Field 8: 10K; Part Field 9: 10K; Part Field 10: 10K; Part Field 11: 10K; Part Field 12: 10K; Part Field 13: 10K; Part Field 14: 10K; Part Field 15: 10K; Part Field 16: 10K
U24 = LT1085: Part Field 1: 10K; Part Field 2: 10K; Part Field 3: 10K; Part Field 4: 10K; Part Field 5: 10K; Part Field 6: 10K; Part Field 7: 10K; Part Field 8: 10K; Part Field 9: 10K; Part Field 10: 10K; Part Field 11: 10K; Part Field 12: 10K; Part Field 13: 10K; Part Field 14: 10K; Part Field 15: 10K; Part Field 16: 10K
U25-U27 = 6N138
Y1 = JT